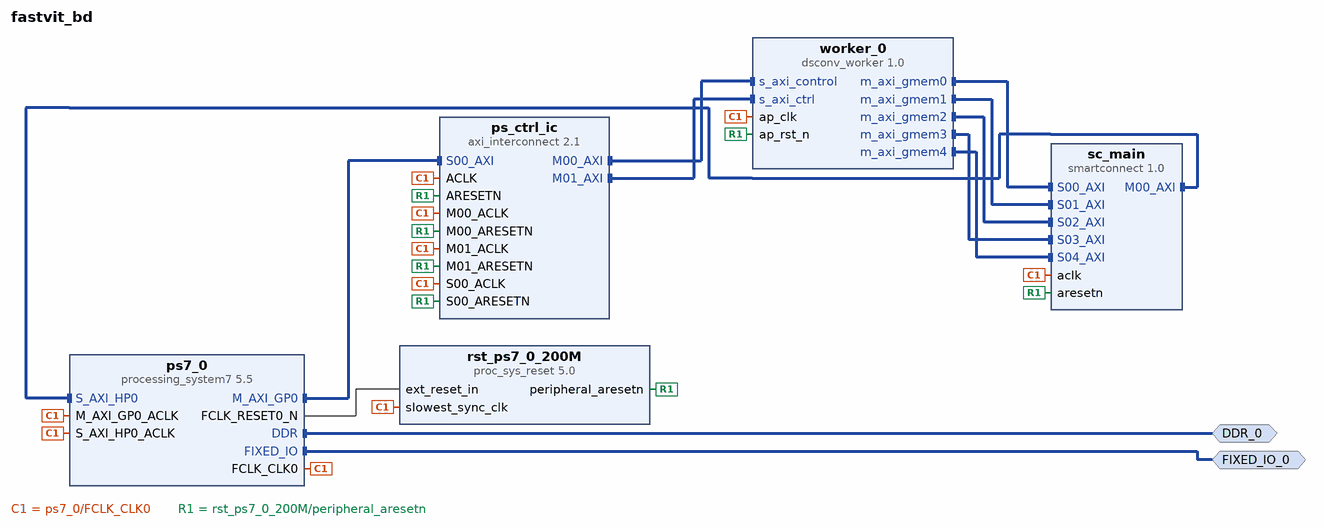
[diagram p0: block diagram of the top level]
# Vivado block design fastvit_bd, xc7z020clg400-1, Vivado 2024.2
create_bd_design fastvit_bd

create_bd_intf_port -mode Master -vlnv xilinx.com:interface:ddrx_rtl:1.0 DDR_0
create_bd_intf_port -mode Master -vlnv xilinx.com:display_processing_system7:fixedio_rtl:1.0 FIXED_IO_0

create_bd_cell -type ip -vlnv xilinx.com:ip:processing_system7:5.5 ps7_0
set_property -dict {CONFIG.PCW_FPGA0_PERIPHERAL_FREQMHZ 200 CONFIG.PCW_USE_S_AXI_HP0 1} [get_bd_cells ps7_0]
# 33 more settings of ps7_0 are not shown: defaults, MIO pin electricals, DDR timing, and values the tool derives
create_bd_cell -type ip -vlnv user.org:hls:dsconv_worker:1.0 worker_0
create_bd_cell -type ip -vlnv xilinx.com:ip:proc_sys_reset:5.0 rst_ps7_0_200M
create_bd_cell -type ip -vlnv xilinx.com:ip:axi_interconnect:2.1 ps_ctrl_ic
set_property -dict {CONFIG.NUM_MI 2 CONFIG.NUM_SI 1} [get_bd_cells ps_ctrl_ic]
create_bd_cell -type ip -vlnv xilinx.com:ip:smartconnect:1.0 sc_main
set_property -dict {CONFIG.NUM_SI 5} [get_bd_cells sc_main]

# ---- connections ----

connect_bd_intf_net [get_bd_intf_ports DDR_0] [get_bd_intf_pins ps7_0/DDR]
connect_bd_intf_net [get_bd_intf_ports FIXED_IO_0] [get_bd_intf_pins ps7_0/FIXED_IO]
connect_bd_intf_net [get_bd_intf_pins ps7_0/M_AXI_GP0] [get_bd_intf_pins ps_ctrl_ic/S00_AXI]
connect_bd_intf_net [get_bd_intf_pins ps_ctrl_ic/M00_AXI] [get_bd_intf_pins worker_0/s_axi_control]
connect_bd_intf_net [get_bd_intf_pins ps_ctrl_ic/M01_AXI] [get_bd_intf_pins worker_0/s_axi_ctrl]
connect_bd_intf_net [get_bd_intf_pins sc_main/M00_AXI] [get_bd_intf_pins ps7_0/S_AXI_HP0]
connect_bd_intf_net [get_bd_intf_pins worker_0/m_axi_gmem0] [get_bd_intf_pins sc_main/S00_AXI]
connect_bd_intf_net [get_bd_intf_pins worker_0/m_axi_gmem1] [get_bd_intf_pins sc_main/S01_AXI]
connect_bd_intf_net [get_bd_intf_pins worker_0/m_axi_gmem2] [get_bd_intf_pins sc_main/S02_AXI]
connect_bd_intf_net [get_bd_intf_pins worker_0/m_axi_gmem3] [get_bd_intf_pins sc_main/S03_AXI]
connect_bd_intf_net [get_bd_intf_pins worker_0/m_axi_gmem4] [get_bd_intf_pins sc_main/S04_AXI]
connect_bd_net [get_bd_pins ps7_0/FCLK_CLK0] \
  [get_bd_pins rst_ps7_0_200M/slowest_sync_clk] [get_bd_pins worker_0/ap_clk] [get_bd_pins ps7_0/M_AXI_GP0_ACLK] \
  [get_bd_pins ps7_0/S_AXI_HP0_ACLK] [get_bd_pins ps_ctrl_ic/ACLK] [get_bd_pins ps_ctrl_ic/S00_ACLK] \
  [get_bd_pins ps_ctrl_ic/M00_ACLK] [get_bd_pins ps_ctrl_ic/M01_ACLK] [get_bd_pins sc_main/aclk]
connect_bd_net [get_bd_pins ps7_0/FCLK_RESET0_N] [get_bd_pins rst_ps7_0_200M/ext_reset_in]
connect_bd_net [get_bd_pins rst_ps7_0_200M/peripheral_aresetn] \
  [get_bd_pins worker_0/ap_rst_n] [get_bd_pins ps_ctrl_ic/ARESETN] [get_bd_pins ps_ctrl_ic/S00_ARESETN] \
  [get_bd_pins ps_ctrl_ic/M00_ARESETN] [get_bd_pins ps_ctrl_ic/M01_ARESETN] [get_bd_pins sc_main/aresetn]

# ---- address map ----
assign_bd_address -offset 0x40000000 -range 64K -target_address_space [get_bd_addr_spaces ps7_0/Data] [get_bd_addr_segs worker_0/s_axi_control/Reg]
assign_bd_address -offset 0x40010000 -range 64K -target_address_space [get_bd_addr_spaces ps7_0/Data] [get_bd_addr_segs worker_0/s_axi_ctrl/Reg]
assign_bd_address -offset 0x0000000000000000 -range 512M -target_address_space [get_bd_addr_spaces worker_0/Data_m_axi_gmem0] [get_bd_addr_segs ps7_0/S_AXI_HP0/HP0_DDR_LOWOCM]
assign_bd_address -offset 0x0000000000000000 -range 512M -target_address_space [get_bd_addr_spaces worker_0/Data_m_axi_gmem1] [get_bd_addr_segs ps7_0/S_AXI_HP0/HP0_DDR_LOWOCM]
assign_bd_address -offset 0x0000000000000000 -range 512M -target_address_space [get_bd_addr_spaces worker_0/Data_m_axi_gmem2] [get_bd_addr_segs ps7_0/S_AXI_HP0/HP0_DDR_LOWOCM]
assign_bd_address -offset 0x0000000000000000 -range 512M -target_address_space [get_bd_addr_spaces worker_0/Data_m_axi_gmem3] [get_bd_addr_segs ps7_0/S_AXI_HP0/HP0_DDR_LOWOCM]
assign_bd_address -offset 0x0000000000000000 -range 512M -target_address_space [get_bd_addr_spaces worker_0/Data_m_axi_gmem4] [get_bd_addr_segs ps7_0/S_AXI_HP0/HP0_DDR_LOWOCM]

validate_bd_design
save_bd_design
